# Altium schematic sheet Sheet1.SchDoc
size A4; SheetNumber: 1; SheetTotal: 1
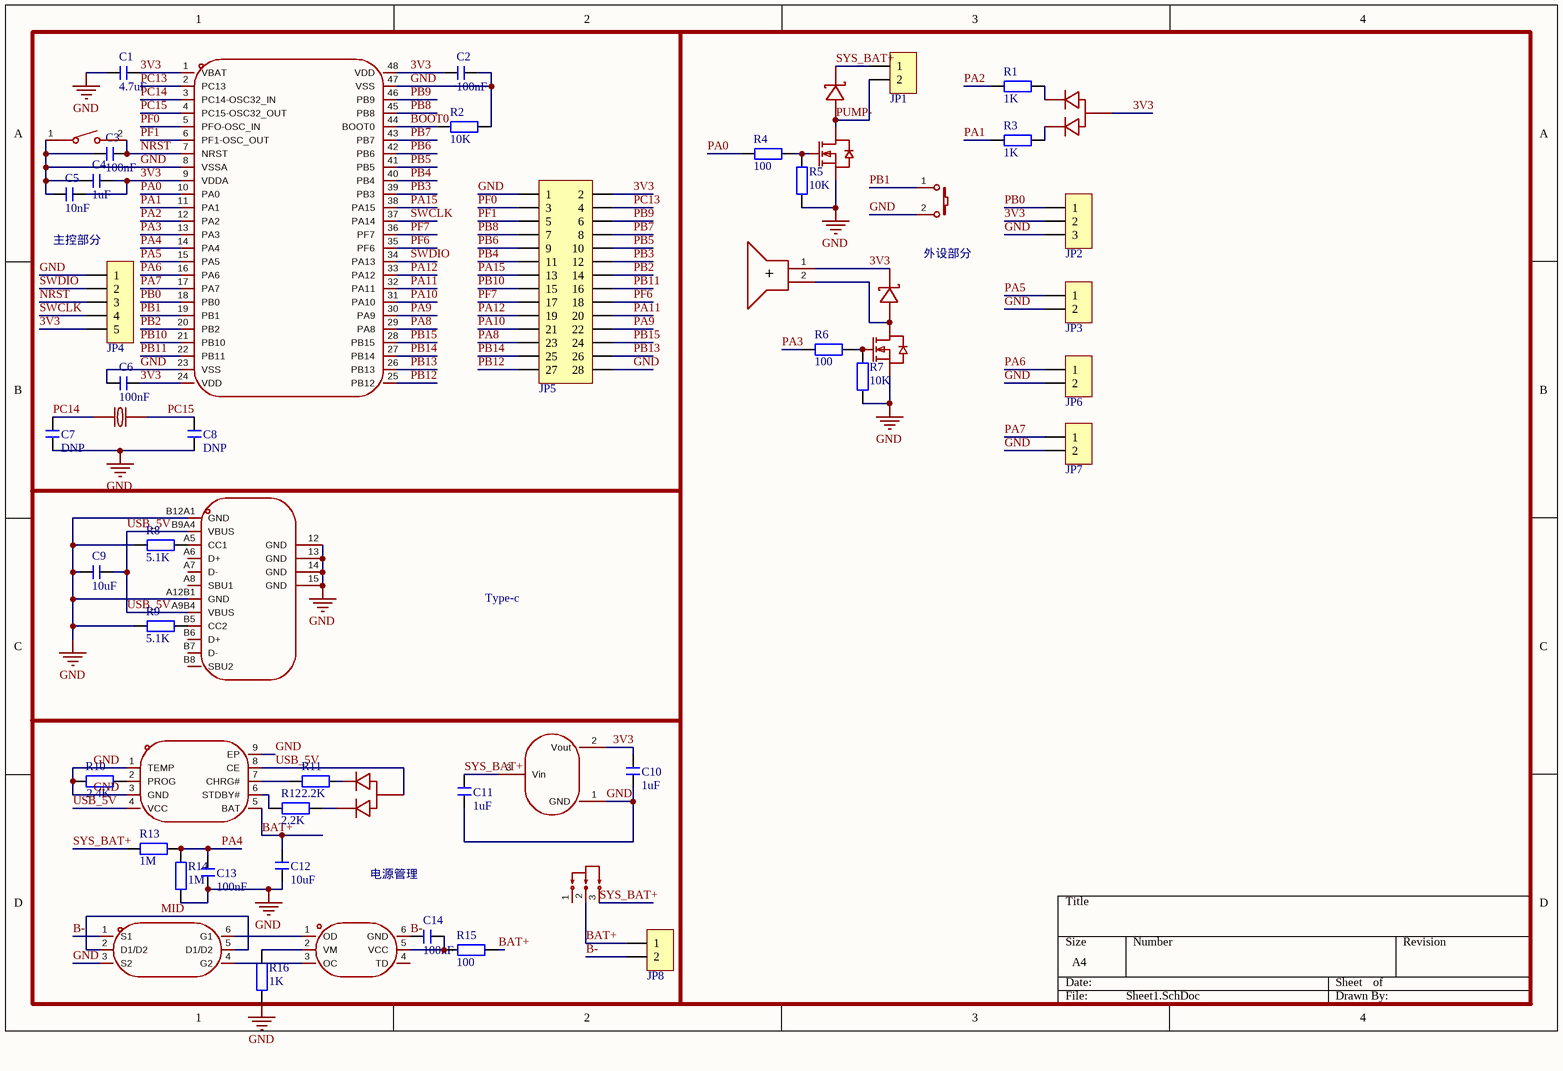
[diagram p0: Sheet1.SchDoc]

## Parts
BUZZER1  hnb09a03  [BUZ-TH_BD9.0-P5.00-D0.6-FD]  (value not drawn)
C1  4.7uF  [C 0603_L]
C2  100nF  [C 0603_L]
C3  100nF  [C 0603_L]
C4  1uF  [C 0603_L]
C5  10nF  [C 0603_L]
C6  100nF  [C 0603_L]
C7  DNP  [C 0603_L]
C8  DNP  [C 0603_L]
C9  10uF  [C 0603_L]
C10  1uF  [C 0603_L]
C11  1uF  [C 0603_L]
C12  10uF  [C 0603_L]
C13  100nF  [C 0603_L]
C14  100nF  [C 0603_L]
Charge_LED  tj-l5fytxhtcylc2r2g-a5  [LED-TH_3P-BD5.9-P2.54-BI]  (value not drawn)
D1  ss14_c83852  [SMA_L4.3-W2.6-LS5.2-RD]  (value not drawn)
D2  ss14_c83852  [SMA_L4.3-W2.6-LS5.2-RD]  (value not drawn)
Function_LED  tj-l5fytxhtcylc2r2g-a5  [LED-TH_3P-BD5.9-P2.54-BI]  (value not drawn)
JP1  HDR-1X2  [XH2.54-LI-2P]  (value not drawn)
JP2  HDR-1X3  [HDR2.54-LI-3P]  (value not drawn)
JP3  HDR-1X2  [XH2.54-LI-2P]  (value not drawn)
JP4  HDR-1X5  [HDR2.54-LI-5P]  (value not drawn)
JP5  Header 2X11  [HDR2.54-LI-2x14P]  (value not drawn)
JP6  HDR-1X2  [XH2.54-LI-2P]  (value not drawn)
JP7  HDR-1X2  [XH2.54-LI-2P]  (value not drawn)
JP8  HDR-1X2  [XH2.54-LI-2P]  (value not drawn)
Q1  ao3400a_c347475  [SOT-23-3_L2.9-W1.3-P1.90-LS2.4-BR]  (value not drawn)
Q2  ao3400a_c347475  [SOT-23-3_L2.9-W1.3-P1.90-LS2.4-BR]  (value not drawn)
Q3  fs8205a  [SOT-23-6_L2.9-W1.6-P0.95-LS2.8-BR]  (value not drawn)
R1  1K  [R 0603_L]
R2  10K  [R 0603_L]
R3  1K  [R 0603_L]
R4  100  [R 0603_L]
R5  10K  [R 0603_L]
R6  100  [R 0603_L]
R7  10K  [R 0603_L]
R8  5.1K  [R 0603_L]
R9  5.1K  [R 0603_L]
R10  2.4K  [R 0603_L]
R11  2.2K  [R 0603_L]
R12  2.2K  [R 0603_L]
R13  1M  [R 0603_L]
R14  1M  [R 0603_L]
R15  100  [R 0603_L]
R16  1K  [R 0603_L]
SW1  ts-1088-ar02016  [SW-SMD_L3.9-W3.0-P4.45]  (value not drawn)
SW2  mx1a-11nw  [SW-TH_MX1A-11NW]  (value not drawn)
U1  stm32f031c6t6  [LQFP-48_L7.0-W7.0-P0.50-LS9.0-BL]  (value not drawn)
U2  xc6206p332mr-g_c5446  [SOT-23-3_L2.9-W1.6-P1.90-LS2.8-BR]  (value not drawn)
U3  tp4056_c382139  [ESOP-8_L4.9-W3.9-P1.27-LS6.0-BL-EP]  (value not drawn)
U4  hx ss12d10g5  [SW-TH_3P-P4.80-HX-SS12D10G4]  (value not drawn)
U5  dw01a_c351410  [SOT-23-6_L2.9-W1.6-P0.95-LS2.8-BL]  (value not drawn)
USB1  typec-16p_c53207138  [USB-C-SMD_TYPEC-16P_C53207138]  (value not drawn)
X1  q13fc13500004_c32346  [FC-135R_L3.2-W1.5]  (value not drawn)

## Nets
GND: C1.1 C2.2 C3.1 C4.1 C5.1 C6.1 C7.1 C8.1 C9.1 C10.1 C11.1 C12.1 C13.1 JP2.3 JP3.2 JP4.1 JP5.1 JP5.28 JP6.2 JP7.2 Q1.2(S) Q2.2(S) Q3.3(S2) R2.2 R5.1 R7.1 R8.1 R9.1 R10.1 R14.1 R16.1 SW1.1 SW2.2 U1.8(VSSA) U1.23(VSS) U1.47(VSS) U2.1(GND) U3.1(TEMP) U3.3(GND) U3.9(EP) USB1.12(GND) USB1.13(GND) USB1.14(GND) USB1.15(GND) USB1.A12B1(GND) USB1.B12A1(GND)
3V3: BUZZER1.1(+) C1.2 C2.1 C4.2 C5.2 C6.2 C10.2 D2.1(K) Function_LED.2(+) JP2.2 JP4.5 JP5.2 U1.1(VBAT) U1.9(VDDA) U1.24(VDD) U1.48(VDD) U2.2(Vout)
B-: C14.2 JP8.2 Q3.1(S1) U5.6(GND)
BAT+: C12.2 JP8.1 R15.1 U3.5(BAT) U4.2
BOOT0: R2.1 U1.44(BOOT0)
MID: Q3.2(D1/D2) Q3.5(D1/D2)
NRST: C3.2 JP4.3 SW1.2 U1.7(NRST)
PA0: R4.1 U1.10(PA0)
PA1: R3.2 U1.11(PA1)
PA2: R1.2 U1.12(PA2)
PA3: R6.2 U1.13(PA3)
PA4: C13.2 R13.1 R14.2 U1.14(PA4)
PA5: JP3.1 U1.15(PA5)
PA6: JP6.1 U1.16(PA6)
PA7: JP7.1 U1.17(PA7)
PA8: JP5.23 U1.29(PA8)
PA9: JP5.22 U1.30(PA9)
PA10: JP5.21 U1.31(PA10)
PA11: JP5.20 U1.32(PA11)
PA12: JP5.19 U1.33(PA12)
PA15: JP5.13 U1.38(PA15)
PB0: JP2.1 U1.18(PB0)
PB1: SW2.1 U1.19(PB1)
PB2: JP5.14 U1.20(PB2)
PB3: JP5.12 U1.39(PB3)
PB4: JP5.11 U1.40(PB4)
PB5: JP5.10 U1.41(PB5)
PB6: JP5.9 U1.42(PB6)
PB7: JP5.8 U1.43(PB7)
PB8: JP5.7 U1.45(PB8)
PB9: JP5.6 U1.46(PB9)
PB10: JP5.15 U1.21(PB10)
PB11: JP5.16 U1.22(PB11)
PB12: JP5.27 U1.25(PB12)
PB13: JP5.26 U1.26(PB13)
PB14: JP5.25 U1.27(PB14)
PB15: JP5.24 U1.28(PB15)
PC13: JP5.4 U1.2(PC13)
PC14: C7.2 U1.3(PC14-OSC32_IN) X1.1
PC15: C8.2 U1.4(PC15-OSC32_OUT) X1.2
PF0: JP5.3 U1.5(PFO-OSC_IN)
PF1: JP5.5 U1.6(PF1-OSC_OUT)
PF6: JP5.18 U1.35(PF6)
PF7: JP5.17 U1.36(PF7)
PUMP-: D1.2(A) JP1.2 Q1.3(D)
SWCLK: JP4.4 U1.37(PA14)
SWDIO: JP4.2 U1.34(PA13)
SYS_BAT+: C11.2 D1.1(K) JP1.1 R13.2 U2.3(Vin) U4.3
USB_5V: C9.2 Charge_LED.2(+) U3.4(VCC) U3.8(CE) USB1.A9B4(VBUS) USB1.B9A4(VBUS)
NetBUZZER1_2: BUZZER1.2(-) D2.2(A) Q2.3(D)
NetC14_1: C14.1 R15.2 U5.5(VCC)
NetCharge_LED_1: Charge_LED.1(-) R11.1
NetCharge_LED_3: Charge_LED.3(R) R12.1
NetFunction_LED_1: Function_LED.1(-) R1.1
NetFunction_LED_3: Function_LED.3(R) R3.1
NetQ1_1: Q1.1(G) R4.2 R5.2
NetQ2_1: Q2.1(G) R6.1 R7.2
NetQ3_4: Q3.4(G2) U5.3(OC)
NetQ3_6: Q3.6(G1) U5.1(OD)
NetR8_2: R8.2 USB1.A5(CC1)
NetR9_2: R9.2 USB1.B5(CC2)
NetR10_2: R10.2 U3.2(PROG)
NetR11_2: R11.2 U3.7(CHRG#)
NetR12_2: R12.2 U3.6(STDBY#)
NetR16_2: R16.2 U5.2(VM)

Not connected (* = marked no-connect by the designer): U4 1; U5 4(TD); USB1 A6(D+) A7(D-) A8(SBU1) B6(D+) B7(D-) B8(SBU2)

## Notes on the sheet
- 主控部分
- 外设部分
- Type-c
- 电源管理

## Library data of the parts
BUZZER1 = hnb09a03: 驱动方式:有源(内含驱动线路);构造类型:电磁式;额定电压:3V;频率:3kHz;声压(SPL):85dB;; Manufacturer: 华能; AddInBom: yes; ModelId: 13273335caac486e928bafb4d9fdf12d; ModelName: BUZ-TH_D9.0-H5.5-P5.0; ModelTransform: 354.33,354.33,0,90,0,0,-0.005,0,-177.165; Voltage Rating: 3V; Voltage - Supply: 1.5V~4.5V; Value: 3kHz; Current Consumption: 30mA; Sound Pressure Level(SPL): 85dB; Symbol: HNB09A03; LCSC Part Name: 电磁式有源一体蜂鸣器HNB09A03; SupplierPart: C96102; ManufacturerPart: HNB09A03; Supplier Footprint: 插件,D=9mm; JLCPCB Part Class: Extended Part; Datasheet: https://item.szlcsc.com/datasheet/HNB09A03/97306.html; Supplier: LCSC; ConvertToPcb: yes; FootprintName: BUZ-TH_BD9.0-P5.00-D0.6-FD; Driver Circuitry: 有源(内含驱动线路); Technology: 电磁式; Diameter(φD): 9mm; Length: -; Width: -; Height: 5.5mm; Operating Temperature: -20℃~+70℃; Mounting Type: -; Lead Pitch: -; Continuous Operating Time: -
C1-C14 = C: 贴片电容; BOM名称: 无极性贴片电容; 淘宝ID: 封装库来自淘宝 ID：黄晶宝石; 联系售后: https://shop463601444.taobao.com
Charge_LED Function_LED = tj-l5fytxhtcylc2r2g-a5: 灯头类型:5mm圆形灯头;发光颜色:红色,翠绿色;正向压降(Vf):1.8V~2.6V；2.8V~3.6V;功率:180mW;正向电流:20mA;波长:515nm~530nm；620nm~630nm;二极管配置:共阳极;透镜颜色:无色透明透镜;色温:-;发光强度:3cd；12cd;发光角度:-;载带方式:-;工作温度:-20℃~+80℃;; Manufacturer: TOGIALED(统佳); AddInBom: yes; ModelId: a0f6434cf7e449c5b15c4f0abbd87fd8; ModelName: LED-TH_3P-BD5.9-H8.6-P2.54; ModelTransform: 225.9838,232.069,0,0,0,0,0,0,-137.795; Illumination Color: 红色,翠绿色; Power(Watts): 180mW; Forward Current: 20mA; Peak Wavelength: 518nm；630nm; Diode Configuration: 共阳极; Lens Color: 无色透明透镜; Symbol: TJ-L5FYTXHTCYLC2R2G-A5; LCSC Part Name: 红灯,翠绿; SupplierPart: C331048; ManufacturerPart: TJ-L5FYTXHTCYLC2R2G-A5; Supplier Footprint: 插件,D=5mm; JLCPCB Part Class: Extended Part; Datasheet: https://item.szlcsc.com/datasheet/TJ-L5FYTXHTCYLC2R2G-A5/310417.html; Supplier: LCSC; ConvertToPcb: yes; FootprintName: LED-TH_3P-BD5.9-P2.54-BI; Lamp Holder Type: 5mm圆形灯头; Voltage - Forward(Vf): 1.8V~2.6V；2.8V~3.6V; Wavelength - Dominant: 515nm~530nm；620nm~630nm; Color Temperature: -; Luminous Intensity: 3cd；12cd; Viewing Angle: -; Mounting Style: -; Operating Temperature: -20℃~+80℃
D1 D2 = ss14_c83852: 正向压降(Vf):500mV@1A;直流反向耐压(Vr):40V;整流电流:1A;; Manufacturer: onsemi(安森美); ManufacturerPart: SS14; AddInBom: yes; ModelId: e3551acb3c5a4975a5e9d36087fe1fa2; ModelTransform: 185.039,102.362,0,0,0,0,0,0,0; Voltage - DC Reverse(Vr): 40V; Current - Rectified: 1A; Reverse Leakage Current (Ir): 200uA@40V; Operating Junction Temperature Range: -65℃~+125℃; Non-Repetitive Peak Forward Surge Current: 40A; Symbol: SS14_C83852; LCSC Part Name: 电压:40V 电流:1A; SupplierPart: C83852; Supplier Footprint: SMA(DO-214AC); JLCPCB Part Class: Extended Part; Datasheet: https://item.szlcsc.com/datasheet/SS14/85019.html; Supplier: LCSC; ConvertToPcb: yes; FootprintName: SMA_L4.3-W2.6-LS5.2-RD; ModelName: SMA_L4.3-W2.6-LS5.2-RD; Voltage - Forward(Vf@If): 500mV@1A
JP1 JP3 JP6-JP8 = Header 2: 2P接插件; 版权归属: 封装库来自淘宝 ID：黄晶宝石; BOM名称: 2P接插件; 联系售后: https://shop463601444.taobao.com
JP2 = Header 3: 3P接插件; 版权归属: 封装库来自淘宝 ID：黄晶宝石; BOM名称: 3P接插件; 学习资源: https://shop463601444.taobao.com
JP4 = Header 5: 5P接插件; 版权归属: 封装库来自淘宝 ID：黄晶宝石; BOM名称: 5P接插件; 学习资源: https://shop463601444.taobao.com
JP5 = Header 14X2: 14*2P接插件; 版权归属: 源创客; BOM名称: 14*2P接插件; 学习资源: www.ooocke.com
Q1 Q2 = ao3400a_c347475: 数量:1个N沟道;漏源电压(Vdss):30V;连续漏极电流(Id):5.8A;导通电阻(RDS(on)):17mΩ@10V;耗散功率(Pd):1.4W;阈值电压(Vgs(th)):1.1V;; Manufacturer: UMW(友台半导体); AddInBom: yes; ModelId: c62791f0466c4ae2a892c056b845b0ca; ModelName: SOT-23-3P_L2.9-W1.3-H1.0-LS2.4-P0.95; ModelTransform: 98.425,114.173,0,180,0,0,0.0005,-0.0005,0; Number: 1个N沟道; Drain to Source Voltage: 30V; Current - Continuous Drain(Id): 5.8A; Pd - Power Dissipation: 1.4W; Gate Threshold Voltage (Vgs(th)): 1.1V; Gate Charge(Qg): 9.7nC@4.5V; Input Capacitance(Ciss): 823pF; Reverse Transfer Capacitance (Crss@Vds): 77pF; Output Capacitance(Coss): 99pF; Symbol: AO3400A_C347475; LCSC Part Name: 1个N沟道 耐压:30V 电流:5.8A; SupplierPart: C347475; ManufacturerPart: AO3400A; Supplier Footprint: SOT-23; JLCPCB Part Class: Extended Part; Datasheet: https://item.szlcsc.com/datasheet/AO3400A/324135.html; Supplier: LCSC; ConvertToPcb: yes; FootprintName: SOT-23-3_L2.9-W1.3-P1.90-LS2.4-BR; RDS(on): 17mΩ@10V; Operating Temperature: -55℃~+150℃
Q3 = fs8205a: 类型:2个N沟道;漏源电压(Vdss):20V;连续漏极电流(Id):6A;导通电阻(RDS(on)@Vgs,Id):25mΩ@2.5V,3A;功率(Pd):1.5W;阈值电压(Vgs(th)@Id):500mV@250uA;; Manufacturer: TECH PUBLIC(台舟); Symbol: FS8205A_C2830320; AddInBom: yes; ModelId: 18da8f6c14a34920b3e136b5c401a119; ModelName: SOT-23-6_L2.9-W1.6-H1.5-LS2.8-P0.95; ModelTransform: 110.73671,114.173,0,180,0,0,0.001,-0.003,0; Type: 2个N沟道; Drain Source Voltage (Vdss): 20V; Continuous Drain Current (Id): 6A; Power Dissipation (Pd): 1.5W; Total Gate Charge (Qg@Vgs): 5.7nC@10V; Input Capacitance (Ciss@Vds): 466pF@10V; Reverse Transfer Capacitance (Crss@Vds): 58pF@10V; LCSC Part Name: 2个N沟道 耐压:20V 电流:6A; SupplierPart: C2830320; ManufacturerPart: FS8205A; Supplier Footprint: SOT-23-6; JLCPCB Part Class: Extended Part; Datasheet: https://atta.szlcsc.com/upload/public/pdf/source/20210810/F53B6D4E8755A1F8E11BAF814CE98E6A.pdf; Supplier: LCSC; ConvertToPcb: yes; FootprintName: SOT-23-6_L2.9-W1.6-P0.95-LS2.8-BR; Drain Source On Resistance (RDS(on)@Vgs,Id): 25mΩ@2.5V,3A; Gate Threshold Voltage (Vgs(th)@Id): 500mV@250uA; Operating Temperature: -55℃~+150℃
R1-R16 = R: 贴片电阻; 版权归属: 来自淘宝 ID：黄晶宝石; BOM名称: 贴片电阻; 联系售后: https://shop463601444.taobao.com
SW1 = ts-1088-ar02016: 电路结构:单刀单掷;按钮形状:圆形按钮;作用力:1.6N;安装方式:立贴;开关长度:3.9mm;开关宽度:3mm;开关高度:2mm;带支架:不带支架;触点电流:50mA;额定电压:12V;带灯:-;工作寿命:10万次;; Manufacturer: XUNPU(讯普); AddInBom: yes; ModelId: b26698b69f274ffabef8a26c7d0e5dd1; ModelName: SW-SMD_L3.9-W2.9-H2.0-LS4.8; ModelTransform: 188.976,114.174,0,0,0,0,0,0,0; Circuit: 单刀单掷; Actuator Style: 圆形按钮; Operating Force: 1.6N; Switch Height: 2mm; with Bracket: 不带支架; Contact Current: 50mA; Voltage Rating: 12V; Actuator/Cap Color: 黑色; Life: 10万次; Symbol: TS-1088-AR02016; LCSC Part Name: 3.9*3*2mm 立贴 轻触开关; SupplierPart: C720477; ManufacturerPart: TS-1088-AR02016; Supplier Footprint: SMD,4x3mm; JLCPCB Part Class: Basic Part; Datasheet: https://item.szlcsc.com/datasheet/TS-1088-AR02016/763484.html; Supplier: LCSC; ConvertToPcb: yes; FootprintName: SW-SMD_L3.9-W3.0-P4.45; Mounting Type: 立贴; Length: 3.9mm; Width: 3mm; With Lamp: -; IP Rating: -; Termination Style: SMD接片; Operating Temperature: -30℃~+80℃
SW2 = mx1a-11nw: Manufacturer: CHERRY; AddInBom: yes; ModelId: 82a0b1b0736d4246abdfab1c08b9c459; ModelTransform: 614.172,614.172,0,0,0,0,24.409,-150.59,-125.984; Symbol: MX1A-11NW; LCSC Part Name: MX1A-11NW; SupplierPart: C3316924; ManufacturerPart: MX1A-11NW; Supplier Footprint: -; JLCPCB Part Class: Extended Part; Datasheet: https://item.szlcsc.com/datasheet/MX1A-11NW/3881518.html; Supplier: LCSC; ConvertToPcb: yes; FootprintName: SW-TH_MX1A-11NW; ModelName: SW-TH_MX1A-11NW
U1 = stm32f031c6t6: CPU内核:ARM Cortex-M0;CPU最大主频:48MHz;CPU位数:32 Bit;; Manufacturer: ST(意法半导体); AddInBom: yes; ModelId: 093be70396ff421eb2cdb946d5311efc; ModelName: LQFP-48_L7.0-W7.0-H1.4-LS9.0-P0.50; ModelTransform: 354.331,354.331,0,0,0,0,0,0,0; CPU Maximum Speed: 48MHz; Core Size: 32 Bit; Program Storage Size: 32KB; Program Memory Type: FLASH; RAM Size: 4KB; Number of I/O: 39; ADC (Bit): 12bit; Oscillator Type: 内置; Voltage - Supply: 2V~3.6V; Symbol: STM32F031C6T6; LCSC Part Name: 主流ARM Cortex-M0基本型系列MCU，具有32 KB Flash、48 MHz CPU和电机控制; SupplierPart: C97413; ManufacturerPart: STM32F031C6T6; Supplier Footprint: LQFP-48(7x7); JLCPCB Part Class: Extended Part; Datasheet: https://item.szlcsc.com/datasheet/STM32F031C6T6/98621.html; Supplier: LCSC; ConvertToPcb: yes; FootprintName: LQFP-48_L7.0-W7.0-P0.50-LS9.0-BL; CPU Core: ARM Cortex-M0; EEPROM: -; Operating Temperature: -40℃~+85℃
U2 = xc6206p332mr-g_c5446: 输出极性:正极;工作电压:6V;输出电压:3.3V;输出电流:200mA;电源纹波抑制比(PSRR):-;输出类型:固定;; Manufacturer: TOREX(特瑞仕); AddInBom: yes; ModelId: 89cb27a44ab2466697082bb9fd73a7d0; ModelName: SOT-23-3L_L2.9-W1.6-H1.1-LS2.8-P0.95; ModelTransform: 114.173,110.236,0,90,0,0,0,0,0; Output Configuration: 正极; Voltage - Supply: 6V; Output Voltage: 3.3V; Output Current: 200mA; standby current: 1uA; Output Type: 固定; Number of Outputs: 1; Symbol: XC6206P332MR; LCSC Part Name: 3.3V 200mA 6V; SupplierPart: C5446; ManufacturerPart: XC6206P332MR-G; Supplier Footprint: SOT-23-3L; JLCPCB Part Class: Basic Part; Datasheet: https://item.szlcsc.com/datasheet/XC6206P332MR-G/5896.html; Supplier: LCSC; ConvertToPcb: yes; FootprintName: SOT-23-3_L2.9-W1.6-P1.90-LS2.8-BR; Power Supply Rejection Ratio (PSRR): -; Voltage Dropout: -; Noise: -; Features: 短路保护；过流保护; Operating Temperature: -40℃~+85℃@(Ta)
U3 = tp4056_c382139: 工作电压:4V~6V;最大充电电流:1A;电池类型:锂电池;电池节数:1;; Manufacturer: TPOWER(天源); ManufacturerPart: TP4056; AddInBom: yes; ModelId: d3e00daa36c445139c055a3b9efb85d2; ModelName: ESOP-8_L4.9-W3.9-H1.6-LS6.0-P1.27; ModelTransform: 240.157,192.913,0,90,0,0,0,0,0; The Chip Type: 充电芯片; Voltage - Supply: 4V~6V; Charge Current - Max: 1A; Charging Saturation Voltage: 4.2V; Type of Battery: 锂电池; Number of Cells: 1; Battery Temperature Detection: 支持; Supply Current (Iq): 1uA; Symbol: TP4056_C382139; LCSC Part Name: 1A锂电池充电IC; SupplierPart: C382139; Supplier Footprint: ESOP-8; JLCPCB Part Class: Extended Part; Datasheet: https://item.szlcsc.com/datasheet/TP4056/354934.html; Supplier: LCSC; ConvertToPcb: yes; FootprintName: ESOP-8_L4.9-W3.9-P1.27-LS6.0-BL-EP; End-Off Voltage: -; Operating Temperature: -40℃~+85℃; 0V Battery Charge: -; Balance Current: -; Interface: -; Features: 恒压充电；恒流充电；自动再充电；充电终止；软启动；可编程充电电流；欠压锁定；涓流充电
U4 = hx ss12d10g5: 电路结构:单刀双掷;安装方式:直插;开关颜色:黑色;额定电流:2A;额定电压:125V;工作寿命:1万次;; Manufacturer: hanxia(韩下); AddInBom: yes; ModelId: cfce8581009a45839cc96a3fa85751f8; ModelName: SW-TH_SHOU-HAN_SS12D10G4; ModelTransform: 499.999,263.779,0,0,0,0,-0.589,-0.591,-196.85; Circuit: 单刀双掷; Actuator Style: 矩形柱状; Switch Height: 11.6mm; Actuator Color: 黑色; Current Rating: 2A; Voltage Rating: 125V; Life: 1万次; Symbol: HX SS12D10G5; LCSC Part Name: 两档立式插件 3脚拨动开关 柄长5.0mm; SupplierPart: C19189120; ManufacturerPart: HX SS12D10G5; Supplier Footprint: 插件-3P,12.7x6.7mm; JLCPCB Part Class: Extended Part; Datasheet: https://item.szlcsc.com/datasheet/HX%2520SS12D10G5/20414075.html; Supplier: LCSC; ConvertToPcb: yes; FootprintName: SW-TH_3P-P4.80-HX-SS12D10G4; Termination Style: PC引脚; Length: 12.7mm; Width: 6.7mm; Mounting Type: 直插; Operating Temperature: -25℃~+70℃
U5 = dw01a_c351410: 工作电压:300mV~10V;最大充电电流:-;电池类型:锂电池;电池节数:1;; Manufacturer: PUOLOP(迪浦); ManufacturerPart: DW01A; AddInBom: yes; ModelId: 18da8f6c14a34920b3e136b5c401a119; ModelName: SOT-23-6_L2.9-W1.6-H1.5-LS2.8-P0.95; ModelTransform: 110.236,113.364,0,90,0,0,0.0005,0.0005,0; The Chip Type: 保护芯片; Charging Saturation Voltage: 4.3V; End-Off Voltage: 2.5V; Type of Battery: 锂电池; Number of Cells: 1; Battery Temperature Detection: 不支持; 0V Battery Charge: 支持; Supply Current (Iq): 3uA; Symbol: DW01A_C351410; LCSC Part Name: 单节锂离子/锂聚合物电池保护IC; SupplierPart: C351410; Supplier Footprint: SOT-23-6L; JLCPCB Part Class: Extended Part; Datasheet: https://item.szlcsc.com/datasheet/DW01A/327628.html; Supplier: LCSC; ConvertToPcb: yes; FootprintName: SOT-23-6_L2.9-W1.6-P0.95-LS2.8-BL; Voltage - Supply: 300mV~10V; Charge Current - Max: -; Operating Temperature: -40℃~+85℃; Balance Current: -; Interface: -; Features: 过流保护；过充保护；过放保护；短路保护
USB1 = typec-16p_c53207138: 连接器类型:Type-C;协议标准:-;公母:母;安装方式:卧贴;触点数量:16P;端口数量:1;额定电流 - 电源:3A;工作温度:-40℃~+85℃;; Manufacturer: BXCONN(宝讯); AddInBom: yes; Connector Type: Type-C; Gender: 母; Number of Contacts: 16P; Number of Ports: 1; Current Rating-Power: 3A; Voltage Rating: 20V; Connect-Disconnect Life: 1万次; Detection color: 黑色; Symbol: TYPEC-16P_C53207138; LCSC Part Name: Type-C 母 卧贴; SupplierPart: C53207138; ManufacturerPart: TYPEC-16P; Supplier Footprint: SMD; JLCPCB Part Class: Extended Part; Datasheet: https://item.szlcsc.com/datasheet/TYPEC-16P/56243042.html; Supplier: LCSC; ConvertToPcb: yes; FootprintName: USB-C-SMD_TYPEC-16P_C53207138; Protocol Standard: -; Mounting Type: 卧贴; Length: 7.35mm; Operating Temperature: -40℃~+85℃
X1 = q13fc13500004_c32346: 晶振类型:贴片晶振;频率:32.768kHz;常温频差:±20ppm;负载电容:12.5pF;; Manufacturer: EPSON(爱普生); Symbol: Q13FC1350000400; AddInBom: yes; ModelId: 751105e878f044059ef0ee72de95f96e; ModelTransform: 125.984,59.055,0,0,0,0,0,0,0; Normal temperature Frequency Tolerance: ±20ppm; Load Capacitance: 12.5pF; Equivalent Series Resistance(ESR): 70kΩ; LCSC Part Name: 32.768kHz ±20ppm 12.5pF; SupplierPart: C32346; ManufacturerPart: Q13FC13500004; Supplier Footprint: SMD3215-2P; JLCPCB Part Class: Basic Part; Datasheet: https://item.szlcsc.com/datasheet/Q13FC13500004/33310.html; Supplier: LCSC; ConvertToPcb: yes; FootprintName: FC-135R_L3.2-W1.5; ModelName: FC-135R_L3.2-W1.5; Type: 贴片晶振; Value: 32.768kHz; Operating Temperature: -40℃~+85℃